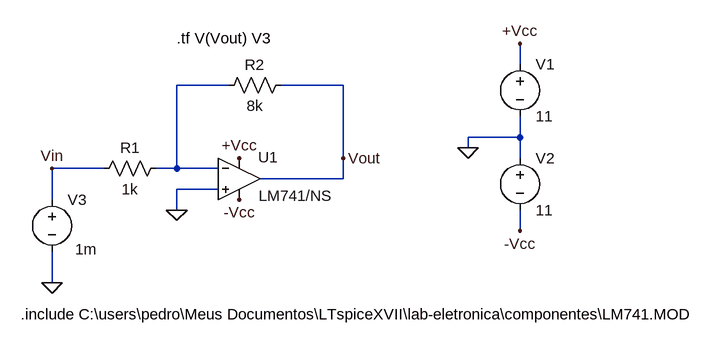
[diagram p0: schematic parte3.asc]
parte3.asc, the LTspice schematic file:
Version 4
SHEET 1 1292 680
WIRE 912 -240 912 -272
WIRE 464 -208 384 -208
WIRE 640 -208 544 -208
WIRE 912 -128 912 -160
WIRE 912 -128 832 -128
WIRE 832 -112 832 -128
WIRE 640 -96 640 -208
WIRE 912 -96 912 -128
WIRE 272 -80 192 -80
WIRE 384 -80 384 -208
WIRE 384 -80 352 -80
WIRE 448 -80 384 -80
WIRE 640 -64 640 -96
WIRE 640 -64 512 -64
WIRE 448 -48 384 -48
WIRE 192 -32 192 -80
WIRE 384 -16 384 -48
WIRE 912 16 912 -16
WIRE 192 96 192 48
FLAG 832 -112 0
FLAG 912 -272 +Vcc
FLAG 912 16 -Vcc
FLAG 480 -96 +Vcc
FLAG 480 -32 -Vcc
FLAG 384 -16 0
FLAG 192 -80 Vin
FLAG 640 -96 Vout
FLAG 192 96 0
SYMBOL OpAmps\\opamp2 480 -128 R0
WINDOW 0 29 31 Left 2
WINDOW 3 30 90 Left 2
SYMATTR InstName U1
SYMATTR Value LM741/NS
SYMBOL voltage 912 -256 R0
WINDOW 123 0 0 Left 0
WINDOW 39 0 0 Left 0
SYMATTR InstName V1
SYMATTR Value 11
SYMBOL voltage 912 -112 R0
WINDOW 123 0 0 Left 0
WINDOW 39 0 0 Left 0
SYMATTR InstName V2
SYMATTR Value 11
SYMBOL voltage 192 -48 R0
WINDOW 3 36 92 Left 2
WINDOW 123 24 124 Left 2
WINDOW 39 0 0 Left 0
SYMATTR InstName V3
SYMATTR Value 1m
SYMBOL res 368 -96 R90
WINDOW 0 0 56 VBottom 2
WINDOW 3 32 56 VTop 2
SYMATTR InstName R1
SYMATTR Value 1k
SYMBOL res 560 -224 R90
WINDOW 0 0 56 VBottom 2
WINDOW 3 32 56 VTop 2
SYMATTR InstName R2
SYMATTR Value 8k
TEXT 144 144 Left 2 !.include C:\\users\\pedro\\Meus Documentos\\LTspiceXVII\\lab-eletronica\\componentes\\LM741.MOD
TEXT 384 -280 Left 2 !.tf V(Vout) V3

The netlist it stands for:
* parte3.asc
XU1 0 N001 +Vcc -Vcc Vout LM741/NS  ; pins In+ In- V+ V- OUT
V1 +Vcc 0 11
V2 0 -Vcc 11
V3 Vin 0 1m
R1 N001 Vin 1k
R2 Vout N001 8k
.include C:\users\pedro\Meus Documentos\LTspiceXVII\lab-eletronica\componentes\LM741.MOD
.tf V(Vout) V3
.backanno
.end